# EAGLE board MC88110_SmokeTest (EAGLE 9.7.0), part 1 of 2
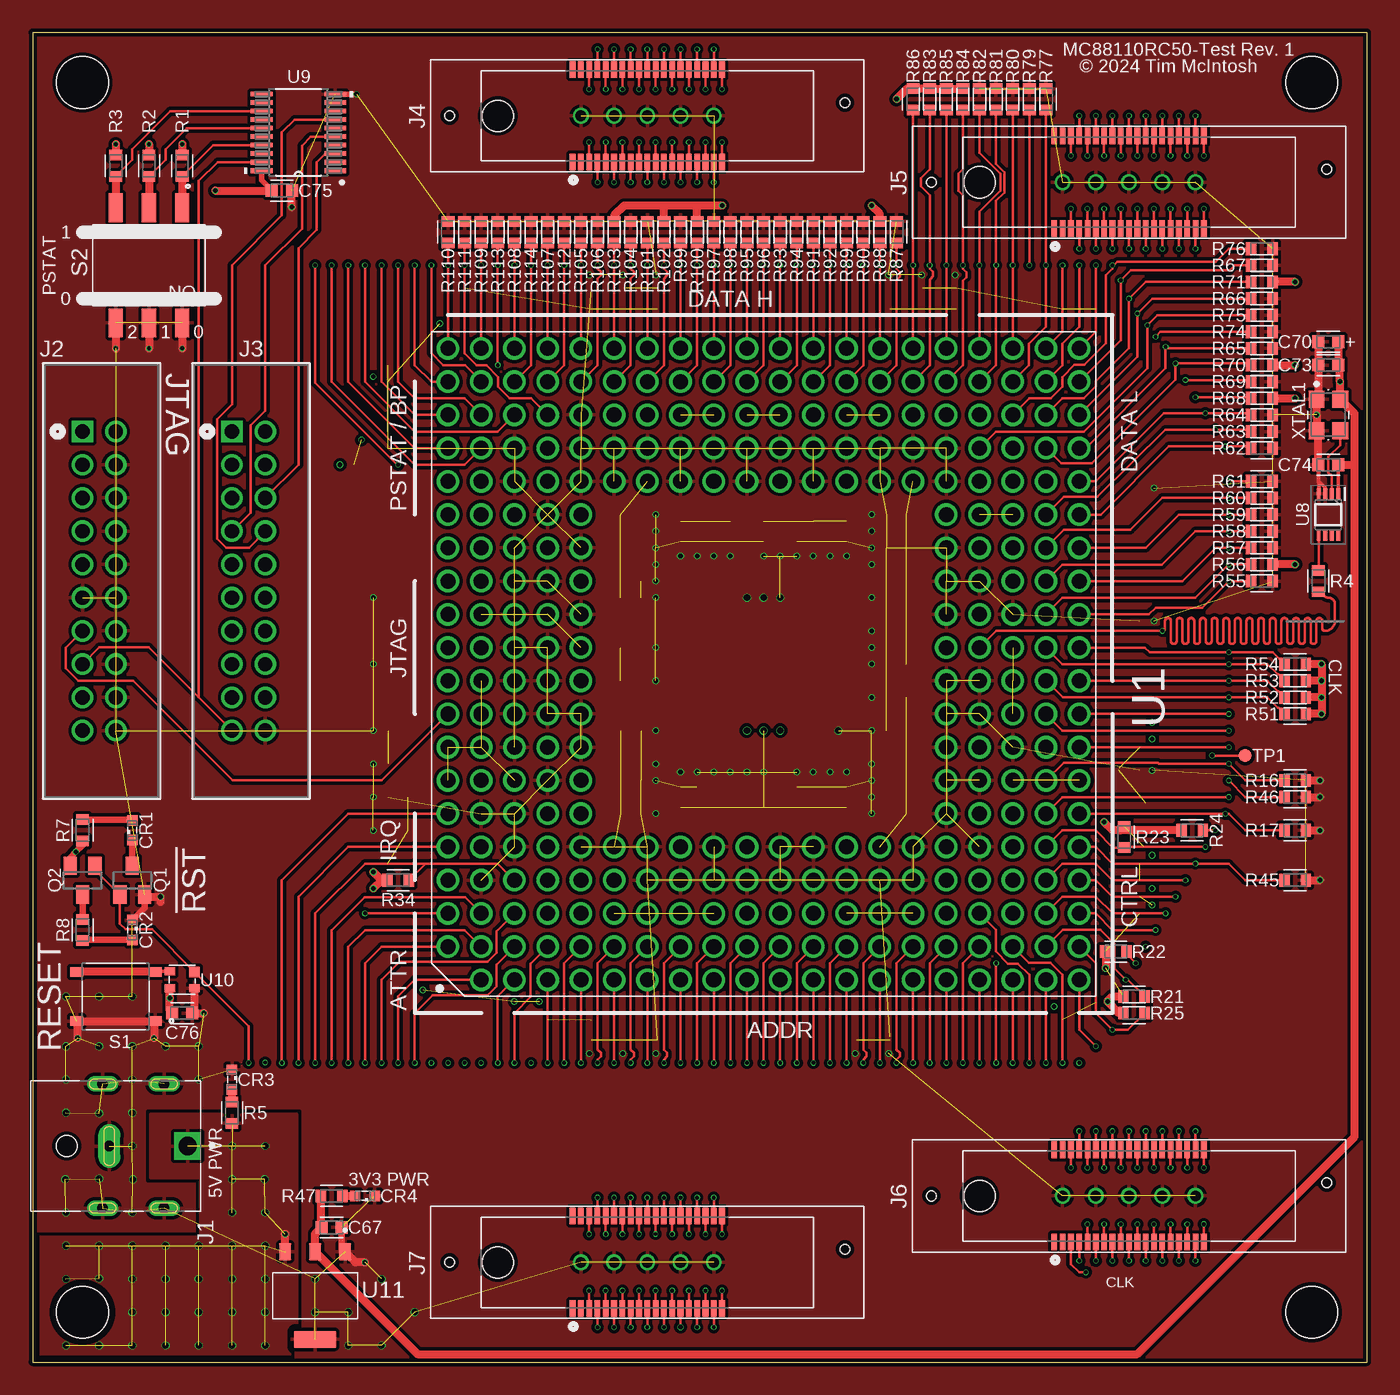
[diagram p2: board, top side]
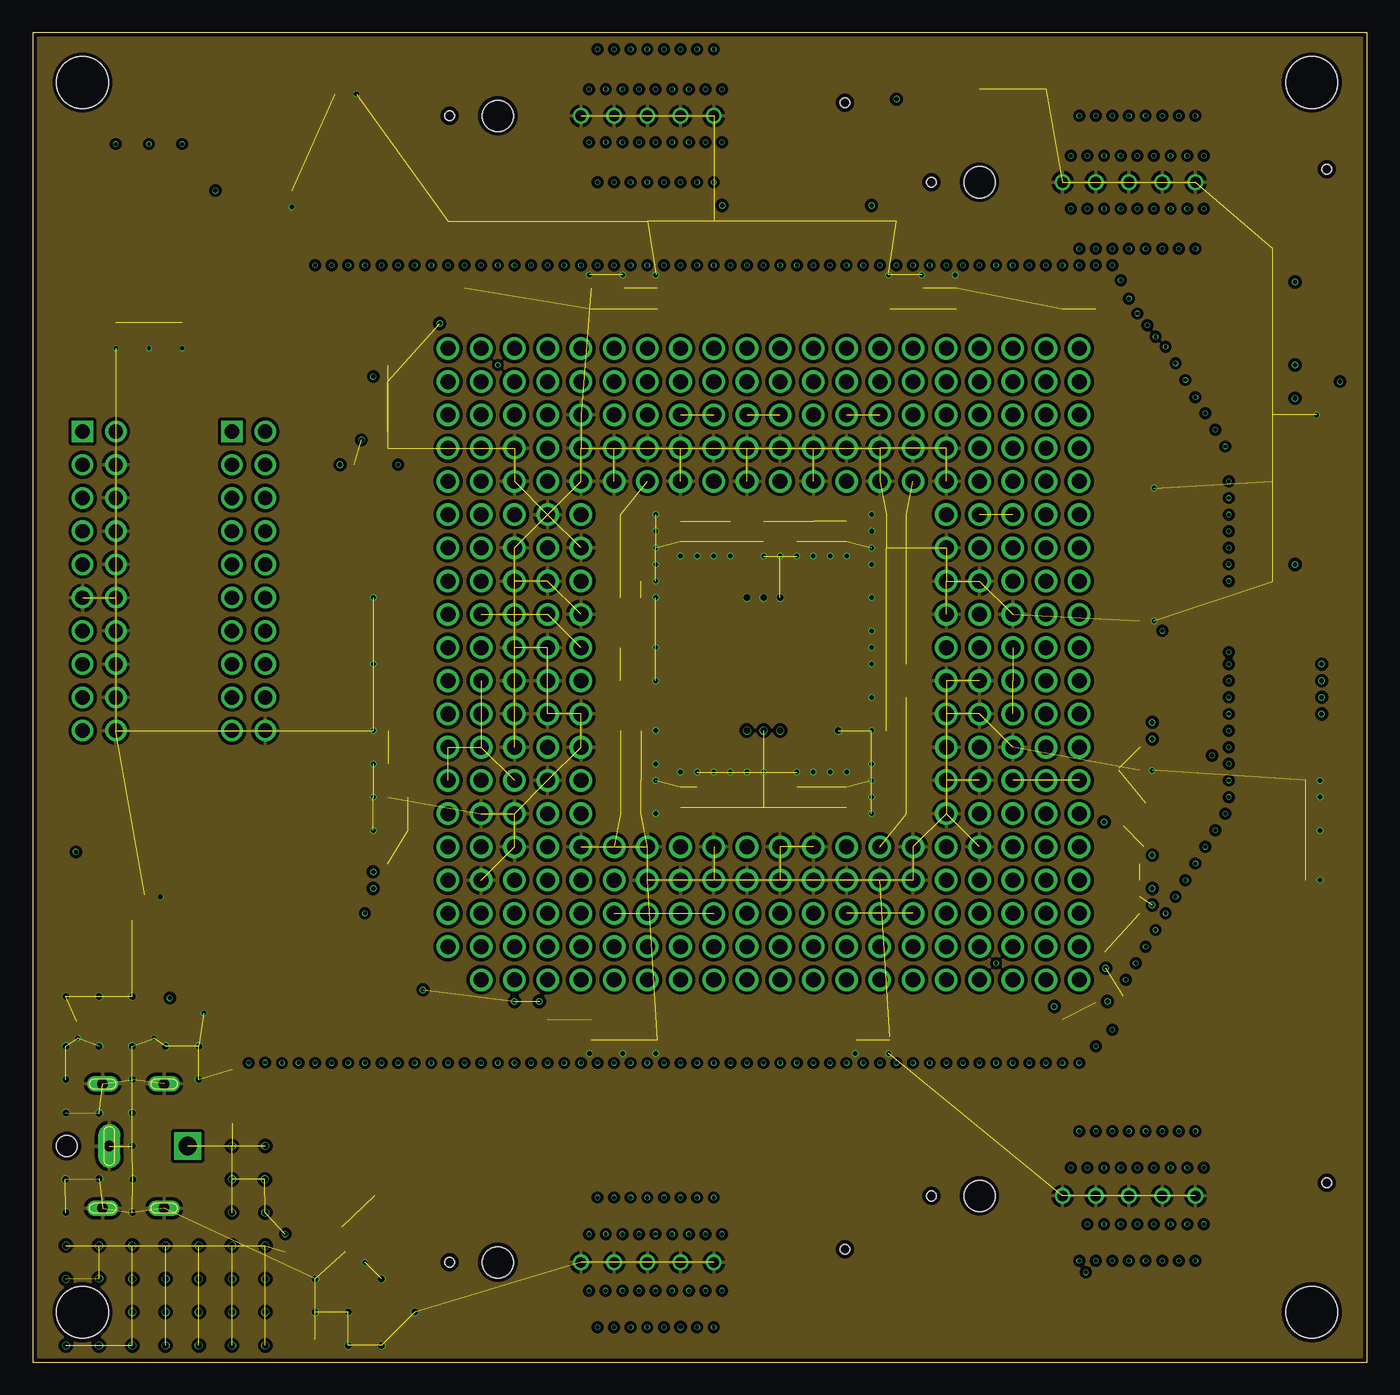
[diagram p3: board, inner layer Route2]
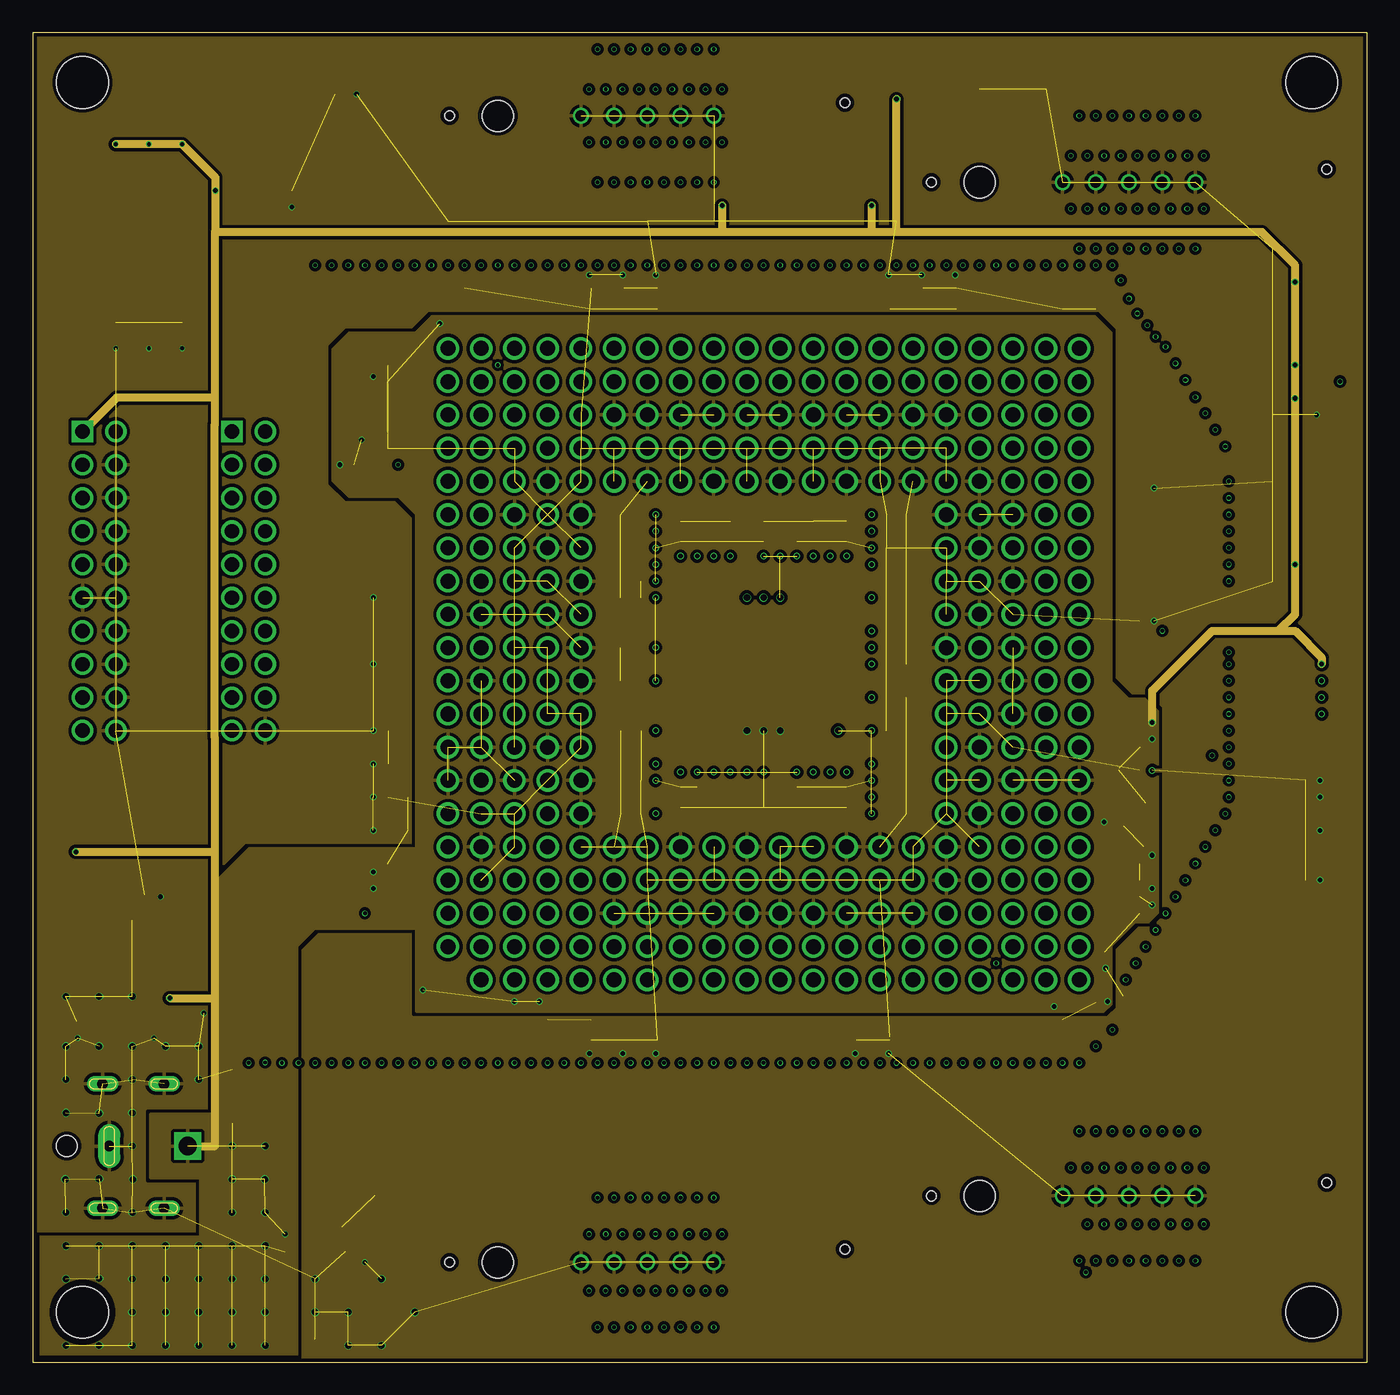
[diagram p4: board, inner layer Route15]
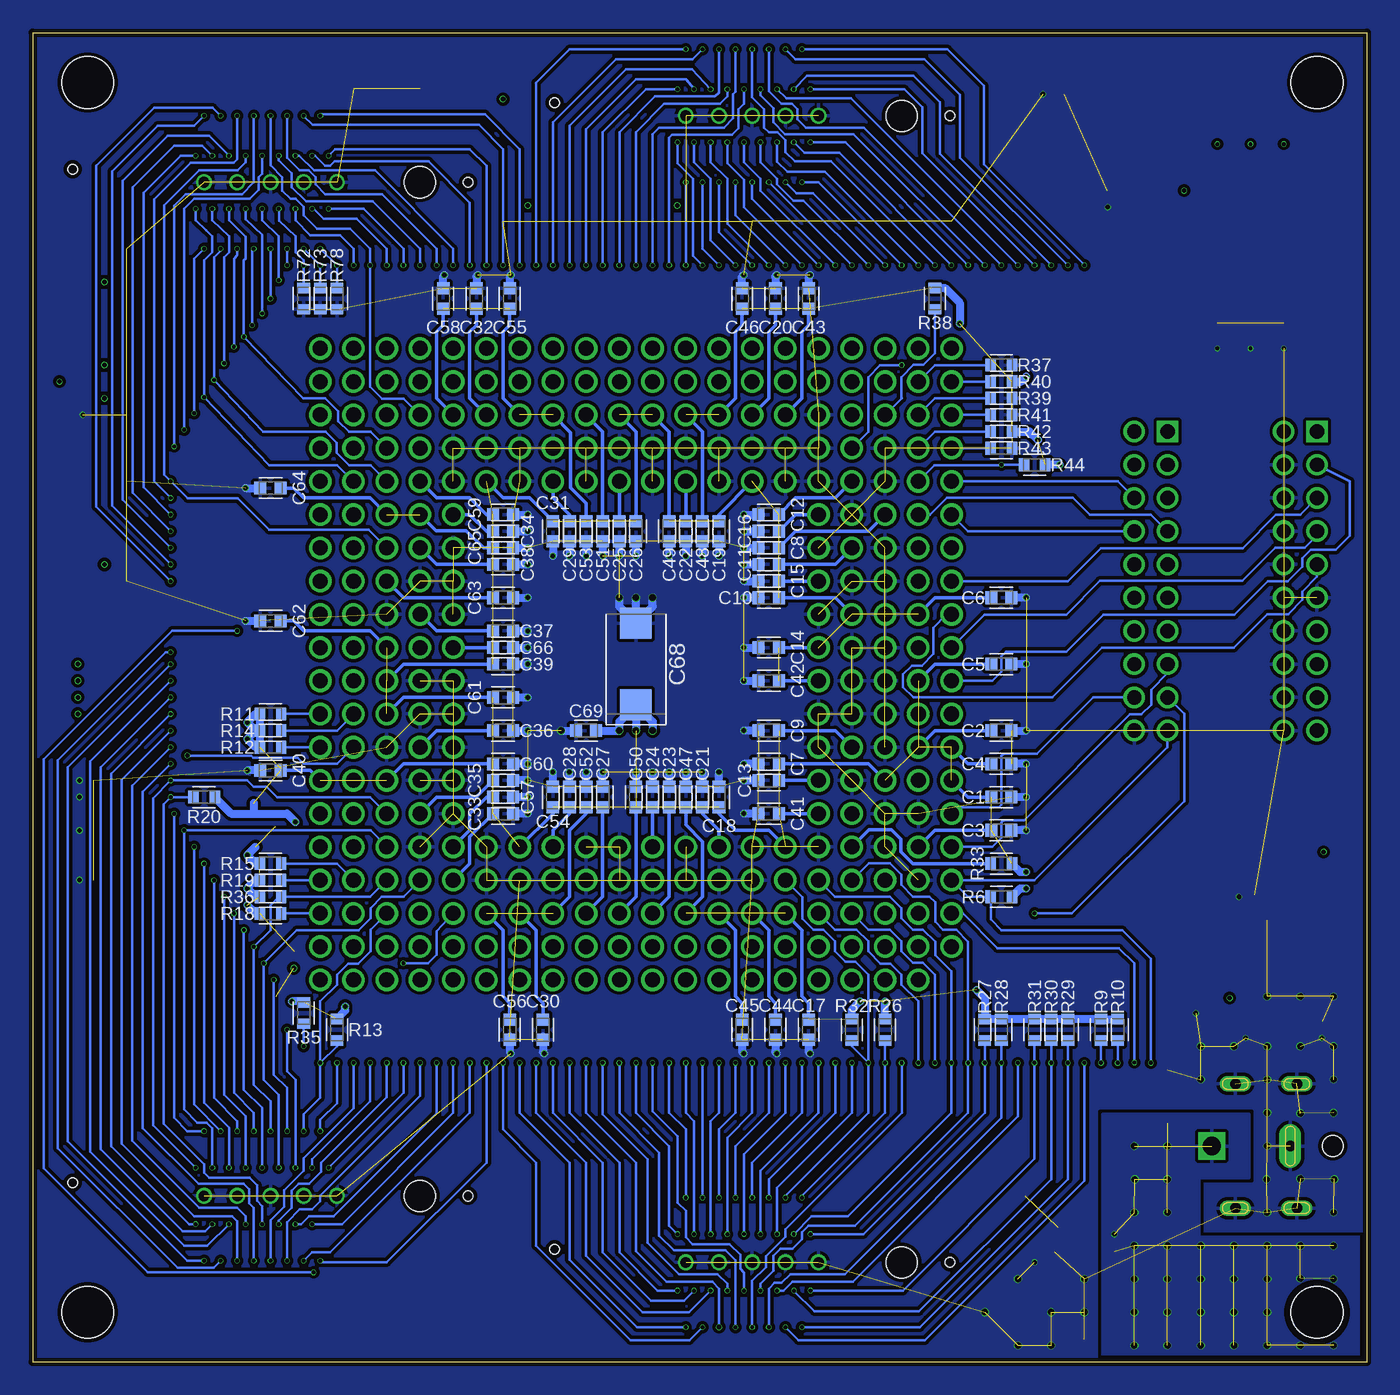
[diagram p5: board, bottom side, seen from below]

Size 102 x 101.6 mm. Coordinates in mm from the lower left corner, seen from the top.
Outline: 0,0 102,0 102,101.6 0,101.6 0,0
Copper layers (1+2+15+16): Top 0.035mm / dielectric 0.2mm / Route2 0.0175mm / dielectric 1.065mm / Route15 0.0175mm / dielectric 0.2mm / Bottom 0.035mm
Design rules "jlcpcb-4layers *": minimum track width 0.09mm, minimum drill 0.2mm, track to track 0.09mm, track to pad 0.2mm, pad to pad 5mil, via to via 0.5mm, smd to smd 5mil, copper to edge 0.3mm, drill to drill 10mil, minimum pad ring 0.05mm, minimum via ring 0.05mm, stop-mask expansion 0.05mm, vias tented up to drill 16mil, thermal gap 10mil
Holes 3.96 mm at 3.81,3.81 3.81,97.79 97.79,97.79 97.79,3.81

## Footprints (pad centres in the part's own frame; a part is rotated, then mirrored left to right if it is on the bottom)
CAPC1608X85 = smd 0.921 x 0.97: 1 -0.775,0; 2 0.775,0
CAPMP7343X310N = smd 2.368 x 2.404: 1 -3.121,0; 2 3.121,0
SML0603 = smd 0.8 x 0.8: A 0.75,0; C -0.75,0
GLOBTECK_JACK-C-PC-10A-RA(R) = drill 1.4 square: 1 5.5,0 | drill 0.8 pad 1.7 long: 2 -0.5,0 | drill 0.8 pad 1.2 long: P1 3.7,4.75; P2 3.7,-4.75; P3 -1,4.75; P4 -1,-4.75 | hole 1.6: -3.75,0
CONN_30320-6002HB_3MM = drill 1.092 pad 1.6 square: 1 -11.43,-1.27 | drill 1.092 pad 1.6: 2 -11.43,1.27; 3 -8.89,-1.27; 4 -8.89,1.27; 5 -6.35,-1.27; 6 -6.35,1.27; 7 -3.81,-1.27; 8 -3.81,1.27; 9 -1.27,-1.27; 10 -1.27,1.27; 11 1.27,-1.27; 12 1.27,1.27; 13 3.81,-1.27; 14 3.81,1.27; 15 6.35,-1.27; 16 6.35,1.27; 17 8.89,-1.27; 18 8.89,1.27; 19 11.43,-1.27; 20 11.43,1.27
TE_2-767004-2 = smd 1.27 x 0.43: 1 -3.53,5.715; 2 3.53,5.715; 3 -3.53,5.08; 4 3.53,5.08; 5 -3.53,4.445; 6 3.53,4.445; 7 -3.53,3.81; 8 3.53,3.81; 9 -3.53,3.175; 10 3.53,3.175; 11 -3.53,2.54; 12 3.53,2.54; 13 -3.53,1.905; 14 3.53,1.905; 15 -3.53,1.27; 16 3.53,1.27; 17 -3.53,0.635; 18 3.53,0.635; 19 -3.53,0; 20 3.53,0; 21 -3.53,-0.635; 22 3.53,-0.635; 23 -3.53,-1.27; 24 3.53,-1.27; 25 -3.53,-1.905; 26 3.53,-1.905; 27 -3.53,-2.54; 28 3.53,-2.54; 29 -3.53,-3.175; 30 3.53,-3.175; 31 -3.53,-3.81; 32 3.53,-3.81; 33 -3.53,-4.445; 34 3.53,-4.445; 35 -3.53,-5.08; 36 3.53,-5.08; 37 -3.53,-5.715; 38 3.53,-5.715 | drill 0.81: G1 0,5.08; G2 0,2.54; G3 0,0; G4 0,-2.54; G5 0,-5.08 | hole 2.39: 0,11.43 | hole 0.76: 0,15.115; 1,-15.115
SOT23 = smd 1 x 1.4: 1 -0.95,-1.1; 2 0.95,-1.1; 3 0,1.1
RESC1608X60 = smd 0.799 x 0.974: 1 -0.815,0; 2 0.815,0
SW_TS-1187A-B-A-B = smd 1 x 0.75: A -3,1.875; B 3,1.875; C -3,-1.875; D 3,-1.875
SW_DS04-254-1-03BK-SMT = smd 2.2 x 1.1: 1A -4.4,2.54; 1B 4.4,2.54; 2A -4.4,0; 2B 4.4,0; 3A -4.4,-2.54; 3B 4.4,-2.54
TP10R = smd 1 x 1: TP 0,0
PGA299 = drill 1.15 pad 1.5: A2 50.8,48.26; A3 50.8,45.72; A4 50.8,43.18; A5 50.8,40.64; A6 50.8,38.1; A7 50.8,35.56; A8 50.8,33.02; A9 50.8,30.48; A10 50.8,27.94; A11 50.8,25.4; A12 50.8,22.86; A13 50.8,20.32; A14 50.8,17.78; A15 50.8,15.24; A16 50.8,12.7; A17 50.8,10.16; A18 50.8,7.62; A19 50.8,5.08; A20 50.8,2.54; B1 48.26,50.8; B2 48.26,48.26; B3 48.26,45.72; B4 48.26,43.18; B5 48.26,40.64; B6 48.26,38.1; B7 48.26,35.56; B8 48.26,33.02; B9 48.26,30.48; B10 48.26,27.94; B11 48.26,25.4; B12 48.26,22.86; B13 48.26,20.32; B14 48.26,17.78; B15 48.26,15.24; B16 48.26,12.7; B17 48.26,10.16; B18 48.26,7.62; B19 48.26,5.08; B20 48.26,2.54; C1 45.72,50.8; C2 45.72,48.26; C3 45.72,45.72; C4 45.72,43.18; C5 45.72,40.64; C6 45.72,38.1; C7 45.72,35.56; C8 45.72,33.02; C9 45.72,30.48; C10 45.72,27.94; C11 45.72,25.4; C12 45.72,22.86; C13 45.72,20.32; C14 45.72,17.78; C15 45.72,15.24; C16 45.72,12.7; C17 45.72,10.16; C18 45.72,7.62; C19 45.72,5.08; C20 45.72,2.54; D1 43.18,50.8; D2 43.18,48.26; D3 43.18,45.72; D4 43.18,43.18; D5 43.18,40.64; D6 43.18,38.1; D7 43.18,35.56; D8 43.18,33.02; D9 43.18,30.48; D10 43.18,27.94; D11 43.18,25.4; D12 43.18,22.86; D13 43.18,20.32; D14 43.18,17.78; D15 43.18,15.24; D16 43.18,12.7; D17 43.18,10.16; D18 43.18,7.62; D19 43.18,5.08; D20 43.18,2.54; E1 40.64,50.8; E2 40.64,48.26; E3 40.64,45.72; E4 40.64,43.18; E5 40.64,40.64; E6 40.64,38.1; E7 40.64,35.56; E8 40.64,33.02; E9 40.64,30.48; E10 40.64,27.94; E11 40.64,25.4; E12 40.64,22.86; E13 40.64,20.32; E14 40.64,17.78; E15 40.64,15.24; E16 40.64,12.7; E17 40.64,10.16; E18 40.64,7.62; E19 40.64,5.08; E20 40.64,2.54; F1 38.1,50.8; F2 38.1,48.26; F3 38.1,45.72; F4 38.1,43.18; F5 38.1,40.64; F16 38.1,12.7; F17 38.1,10.16; F18 38.1,7.62; F19 38.1,5.08; F20 38.1,2.54; G1 35.56,50.8; G2 35.56,48.26; G3 35.56,45.72; G4 35.56,43.18; G5 35.56,40.64; G16 35.56,12.7; G17 35.56,10.16; G18 35.56,7.62; G19 35.56,5.08; G20 35.56,2.54; H1 33.02,50.8; H2 33.02,48.26; H3 33.02,45.72; H4 33.02,43.18; H5 33.02,40.64; H16 33.02,12.7; H17 33.02,10.16; H18 33.02,7.62; H19 33.02,5.08; H20 33.02,2.54; J1 30.48,50.8; J2 30.48,48.26; J3 30.48,45.72; J4 30.48,43.18; J5 30.48,40.64; J16 30.48,12.7; J17 30.48,10.16; J18 30.48,7.62; J19 30.48,5.08; J20 30.48,2.54; K1 27.94,50.8; K2 27.94,48.26; K3 27.94,45.72; K4 27.94,43.18; K5 27.94,40.64; K16 27.94,12.7; K17 27.94,10.16; K18 27.94,7.62; K19 27.94,5.08; K20 27.94,2.54; L1 25.4,50.8; L2 25.4,48.26; L3 25.4,45.72; L4 25.4,43.18; L5 25.4,40.64; L16 25.4,12.7; L17 25.4,10.16; L18 25.4,7.62; L19 25.4,5.08; L20 25.4,2.54; M1 22.86,50.8; M2 22.86,48.26; M3 22.86,45.72; M4 22.86,43.18; M5 22.86,40.64; M16 22.86,12.7; M17 22.86,10.16; M18 22.86,7.62; M19 22.86,5.08; M20 22.86,2.54; N1 20.32,50.8; N2 20.32,48.26; N3 20.32,45.72; N4 20.32,43.18; N5 20.32,40.64; N16 20.32,12.7; N17 20.32,10.16; N18 20.32,7.62; N19 20.32,5.08; N20 20.32,2.54; P1 17.78,50.8; P2 17.78,48.26; P3 17.78,45.72; P4 17.78,43.18; P5 17.78,40.64; P16 17.78,12.7; P17 17.78,10.16; P18 17.78,7.62; P19 17.78,5.08; P20 17.78,2.54; R1 15.24,50.8; R2 15.24,48.26; R3 15.24,45.72; R4 15.24,43.18; R5 15.24,40.64; R16 15.24,12.7; R17 15.24,10.16; R18 15.24,7.62; R19 15.24,5.08; R20 15.24,2.54; S1 12.7,50.8; S2 12.7,48.26; S3 12.7,45.72; S4 12.7,43.18; S5 12.7,40.64; S6 12.7,38.1; S7 12.7,35.56; S8 12.7,33.02; S9 12.7,30.48; S10 12.7,27.94; S11 12.7,25.4; S12 12.7,22.86; S13 12.7,20.32; S14 12.7,17.78; S15 12.7,15.24; S16 12.7,12.7; S17 12.7,10.16; S18 12.7,7.62; S19 12.7,5.08; S20 12.7,2.54; T1 10.16,50.8; T2 10.16,48.26; T3 10.16,45.72; T4 10.16,43.18; T5 10.16,40.64; T6 10.16,38.1; T7 10.16,35.56; T8 10.16,33.02; T9 10.16,30.48; T10 10.16,27.94; T11 10.16,25.4; T12 10.16,22.86; T13 10.16,20.32; T14 10.16,17.78; T15 10.16,15.24; T16 10.16,12.7; T17 10.16,10.16; T18 10.16,7.62; T19 10.16,5.08; T20 10.16,2.54; U1 7.62,50.8; U2 7.62,48.26; U3 7.62,45.72; U4 7.62,43.18; U5 7.62,40.64; U6 7.62,38.1; U7 7.62,35.56; U8 7.62,33.02; U9 7.62,30.48; U10 7.62,27.94; U11 7.62,25.4; U12 7.62,22.86; U13 7.62,20.32; U14 7.62,17.78; U15 7.62,15.24; U16 7.62,12.7; U17 7.62,10.16; U18 7.62,7.62; U19 7.62,5.08; U20 7.62,2.54; V1 5.08,50.8; V2 5.08,48.26; V3 5.08,45.72; V4 5.08,43.18; V5 5.08,40.64; V6 5.08,38.1; V7 5.08,35.56; V8 5.08,33.02; V9 5.08,30.48; V10 5.08,27.94; V11 5.08,25.4; V12 5.08,22.86; V13 5.08,20.32; V14 5.08,17.78; V15 5.08,15.24; V16 5.08,12.7; V17 5.08,10.16; V18 5.08,7.62; V19 5.08,5.08; V20 5.08,2.54; W1 2.54,50.8; W2 2.54,48.26; W3 2.54,45.72; W4 2.54,43.18; W5 2.54,40.64; W6 2.54,38.1; W7 2.54,35.56; W8 2.54,33.02; W9 2.54,30.48; W10 2.54,27.94; W11 2.54,25.4; W12 2.54,22.86; W13 2.54,20.32; W14 2.54,17.78; W15 2.54,15.24; W16 2.54,12.7; W17 2.54,10.16; W18 2.54,7.62; W19 2.54,5.08; W20 2.54,2.54
SOP50P310X100-8N = smd 0.85 x 0.3: 1 -1.575,0.75; 2 -1.575,0.25; 3 -1.575,-0.25; 4 -1.575,-0.75; 5 1.575,-0.75; 6 1.575,-0.25; 7 1.575,0.25; 8 1.575,0.75
PW20 = smd 1.676 x 0.356: 1 -2.819,2.925; 2 -2.819,2.275; 3 -2.819,1.625; 4 -2.819,0.975; 5 -2.819,0.325; 6 -2.819,-0.325; 7 -2.819,-0.975; 8 -2.819,-1.625; 9 -2.819,-2.275; 10 -2.819,-2.925; 11 2.819,-2.925; 12 2.819,-2.275; 13 2.819,-1.625; 14 2.819,-0.975; 15 2.819,-0.325; 16 2.819,0.325; 17 2.819,0.975; 18 2.819,1.625; 19 2.819,2.275; 20 2.819,2.925
R3132Q = smd 0.6 x 0.8: P$1 -0.65,-0.95; P$3 0.65,0.95; P$4 -0.65,0.95 | smd 0.8 x 0.8: P$2 0.6,-0.95
SOT229P700X180-4N = smd 1.31 x 0.93: 1 -3.345,2.29; 2 -3.345,0; 3 -3.345,-2.29 | smd 1.31 x 3.24: 4 3.345,0
OSCCC320X250X90 = smd 1.312 x 1.212: 1 -1.2,-0.9; 2 1.2,-0.9; 3 1.2,0.9; 4 -1.2,0.9

## Placement (x,y rotation side)
C1  100nF  [CAPC1608X85]  27.94,43.18 0 bottom
C2  100nF  [CAPC1608X85]  27.94,48.26 0 bottom
C3  100nF  [CAPC1608X85]  27.94,40.64 0 bottom
C4  100nF  [CAPC1608X85]  27.94,45.72 0 bottom
C5  100nF  [CAPC1608X85]  27.94,53.34 0 bottom
C6  100nF  [CAPC1608X85]  27.94,58.42 0 bottom
C7  100nF  [CAPC1608X85]  45.72,45.72 180 bottom
C8  100nF  [CAPC1608X85]  45.72,62.23 180 bottom
C9  100nF  [CAPC1608X85]  45.72,48.26 180 bottom
C10  100nF  [CAPC1608X85]  45.72,58.42 180 bottom
C11  100nF  [CAPC1608X85]  45.72,60.96 180 bottom
C12  100nF  [CAPC1608X85]  45.72,64.77 180 bottom
C13  100nF  [CAPC1608X85]  45.72,44.45 180 bottom
C14  100nF  [CAPC1608X85]  45.72,54.61 180 bottom
C15  100nF  [CAPC1608X85]  45.72,59.69 180 bottom
C16  100nF  [CAPC1608X85]  45.72,63.5 180 bottom
C17  100nF  [CAPC1608X85]  42.67,25.4 270 bottom
C18  100nF  [CAPC1608X85]  49.53,43.18 90 bottom
C19  100nF  [CAPC1608X85]  49.53,63.5 270 bottom
C20  100nF  [CAPC1608X85]  45.21,81.28 90 bottom
C21  100nF  [CAPC1608X85]  50.8,43.18 90 bottom
C22  100nF  [CAPC1608X85]  52.07,63.5 270 bottom
C23  100nF  [CAPC1608X85]  53.34,43.18 90 bottom
C24  100nF  [CAPC1608X85]  54.61,43.18 90 bottom
C25  100nF  [CAPC1608X85]  57.15,63.5 270 bottom
C26  100nF  [CAPC1608X85]  55.88,63.5 270 bottom
C27  100nF  [CAPC1608X85]  58.42,43.18 90 bottom
C28  100nF  [CAPC1608X85]  60.96,43.18 90 bottom
C29  100nF  [CAPC1608X85]  60.96,63.5 270 bottom
C30  100nF  [CAPC1608X85]  62.99,25.4 270 bottom
C31  100nF  [CAPC1608X85]  62.23,63.5 270 bottom
C32  100nF  [CAPC1608X85]  68.07,81.28 90 bottom
C33  100nF  [CAPC1608X85]  66.04,41.91 0 bottom
C34  100nF  [CAPC1608X85]  66.04,63.5 0 bottom
C35  100nF  [CAPC1608X85]  66.04,44.45 0 bottom
C36  100nF  [CAPC1608X85]  66.04,48.26 0 bottom
C37  100nF  [CAPC1608X85]  66.04,55.88 0 bottom
C38  100nF  [CAPC1608X85]  66.04,60.96 0 bottom
C39  100nF  [CAPC1608X85]  66.04,53.34 0 bottom
C40  100nF  [CAPC1608X85]  83.82,45.21 180 bottom
C41  100nF  [CAPC1608X85]  45.72,41.91 180 bottom
C42  100nF  [CAPC1608X85]  45.72,52.07 180 bottom
C43  100nF  [CAPC1608X85]  42.67,81.28 90 bottom
C44  100nF  [CAPC1608X85]  45.21,25.4 270 bottom
C45  100nF  [CAPC1608X85]  47.75,25.4 270 bottom
C46  100nF  [CAPC1608X85]  47.75,81.28 90 bottom
C47  100nF  [CAPC1608X85]  52.07,43.18 90 bottom
C48  100nF  [CAPC1608X85]  50.8,63.5 270 bottom
C49  100nF  [CAPC1608X85]  53.34,63.5 270 bottom
C50  100nF  [CAPC1608X85]  55.88,43.18 90 bottom
C51  100nF  [CAPC1608X85]  58.42,63.5 270 bottom
C52  100nF  [CAPC1608X85]  59.69,43.18 90 bottom
C53  100nF  [CAPC1608X85]  59.69,63.5 270 bottom
C54  100nF  [CAPC1608X85]  62.23,43.18 90 bottom
C55  100nF  [CAPC1608X85]  65.53,81.28 90 bottom
C56  100nF  [CAPC1608X85]  65.53,25.4 270 bottom
C57  100nF  [CAPC1608X85]  66.04,43.18 0 bottom
C58  100nF  [CAPC1608X85]  70.61,81.28 90 bottom
C59  100nF  [CAPC1608X85]  66.04,64.77 0 bottom
C60  100nF  [CAPC1608X85]  66.04,45.72 0 bottom
C61  100nF  [CAPC1608X85]  66.04,50.8 0 bottom
C62  100nF  [CAPC1608X85]  83.82,56.64 180 bottom
C63  100nF  [CAPC1608X85]  66.04,58.42 0 bottom
C64  100nF  [CAPC1608X85]  83.82,66.8 180 bottom
C65  100nF  [CAPC1608X85]  66.04,62.23 0 bottom
C66  100nF  [CAPC1608X85]  66.04,54.61 0 bottom
C67  22uF  [CAPC1608X85]  22.86,10.29 0 top
C68  100uF  [CAPMP7343X310N]  55.88,53.34 90 bottom
C69  22uF  [CAPC1608X85]  59.69,48.26 180 bottom
C70  100uF  [CAPC1608X85]  99.06,77.98 180 top
C73  100nF  [CAPC1608X85]  99.06,76.2 180 top
C74  100nF  [CAPC1608X85]  99.06,68.58 180 top
C75  100nF  [CAPC1608X85]  19.05,89.53 0 top
C76  100nF  [CAPC1608X85]  11.43,26.67 0 top
CR1  GREEN  [SML0603]  7.62,40.64 90 top
CR2  RED  [SML0603]  7.62,33.02 270 top
CR3  GREEN  [SML0603]  15.24,21.59 270 top
CR4  GREEN  [SML0603]  25.4,12.7 180 top
J1  JACK-C-PC-10A-RA(R)  [GLOBTECK_JACK-C-PC-10A-RA(R)]  6.35,16.51 0 top
J2  30320-6002HBCONN_30320-6002HB_3MM  [CONN_30320-6002HB_3MM]  5.08,59.69 270 top
J3  30320-6002HBCONN_30320-6002HB_3MM  [CONN_30320-6002HB_3MM]  16.51,59.69 270 top
J4  [TE_2-767004-2]  46.99,95.25 90 top
J5  [TE_2-767004-2]  83.82,90.17 90 top
J6  [TE_2-767004-2]  83.82,12.7 90 top
J7  [TE_2-767004-2]  46.99,7.62 90 top
Q1  NMOSFET  [SOT23]  7.62,36.83 0 top
Q2  PMOSFET  [SOT23]  3.81,36.83 180 top
R1  1K  [RESC1608X60]  11.43,91.44 90 top
R2  1K  [RESC1608X60]  8.89,91.44 90 top
R3  1K  [RESC1608X60]  6.35,91.44 90 top
R4  0R  [RESC1608X60]  98.3,59.69 270 top
R5  220R  [RESC1608X60]  15.24,19.05 270 top
R6  10K  [RESC1608X60]  27.94,35.56 180 bottom
R7  220R  [RESC1608X60]  3.81,40.64 270 top
R8  330R  [RESC1608X60]  3.81,33.02 90 top
R9  10K  [RESC1608X60]  20.32,25.4 90 bottom
R10  10K  [RESC1608X60]  19.05,25.4 90 bottom
R11  10K  [RESC1608X60]  83.82,49.53 180 bottom
R12  10K  [RESC1608X60]  83.82,46.99 180 bottom
R13  10K  [RESC1608X60]  78.74,25.4 90 bottom
R14  10K  [RESC1608X60]  83.82,48.26 180 bottom
R15  10K  [RESC1608X60]  83.82,38.1 180 bottom
R16  4K7  [RESC1608X60]  96.52,44.45 180 top
R17  4K7  [RESC1608X60]  96.52,40.64 180 top
R18  10K  [RESC1608X60]  83.82,34.29 180 bottom
R19  10K  [RESC1608X60]  83.82,36.83 180 bottom
R20  10K  [RESC1608X60]  88.9,43.18 0 bottom
R21  10K  [RESC1608X60]  84.2,27.94 180 top
R22  10K  [RESC1608X60]  82.8,31.37 180 top
R23  10K  [RESC1608X60]  83.44,40.13 90 top
R24  10K  [RESC1608X60]  88.65,40.64 180 top
R25  10K  [RESC1608X60]  84.2,26.67 180 top
R26  4K7  [RESC1608X60]  36.83,25.4 90 bottom
R27  4K7  [RESC1608X60]  29.21,25.4 90 bottom
R28  4K7  [RESC1608X60]  27.94,25.4 90 bottom
R29  4K7  [RESC1608X60]  22.86,25.4 90 bottom
R30  4K7  [RESC1608X60]  24.13,25.4 90 bottom
R31  4K7  [RESC1608X60]  25.4,25.4 90 bottom
R32  4K7  [RESC1608X60]  39.37,25.4 90 bottom
R33  10K  [RESC1608X60]  27.94,38.1 0 bottom
R34  1K  [RESC1608X60]  27.94,36.83 180 top
R35  1K  [RESC1608X60]  81.28,26.67 90 bottom
R36  1K  [RESC1608X60]  83.82,35.56 180 bottom
R37  1K  [RESC1608X60]  27.94,76.2 0 bottom
R38  1K  [RESC1608X60]  33.02,81.28 90 bottom
R39  1K  [RESC1608X60]  27.94,73.66 0 bottom
R40  1K  [RESC1608X60]  27.94,74.93 0 bottom
R41  1K  [RESC1608X60]  27.94,72.39 0 bottom
R42  1K  [RESC1608X60]  27.94,71.12 0 bottom
R43  1K  [RESC1608X60]  27.94,69.85 0 bottom
R44  1K  [RESC1608X60]  25.4,68.58 0 bottom
R45  4K7  [RESC1608X60]  96.52,36.83 180 top
R46  4K7  [RESC1608X60]  96.52,43.18 180 top
R47  47R  [RESC1608X60]  22.86,12.7 180 top
R51  4K7  [RESC1608X60]  96.52,49.53 0 top
R52  4K7  [RESC1608X60]  96.52,50.8 0 top
R53  4K7  [RESC1608X60]  96.52,52.07 0 top
R54  4K7  [RESC1608X60]  96.52,53.34 0 top
R55  4K7  [RESC1608X60]  93.98,59.69 0 top
R56  4K7  [RESC1608X60]  93.98,60.96 0 top
R57  4K7  [RESC1608X60]  93.98,62.23 0 top
R58  4K7  [RESC1608X60]  93.98,63.5 0 top
R59  4K7  [RESC1608X60]  93.98,64.77 0 top
R60  4K7  [RESC1608X60]  93.98,66.04 0 top
R61  4K7  [RESC1608X60]  93.98,67.31 0 top
R62  4K7  [RESC1608X60]  93.98,69.85 0 top
R63  4K7  [RESC1608X60]  93.98,71.12 0 top
R64  4K7  [RESC1608X60]  93.98,72.39 0 top
R65  4K7  [RESC1608X60]  93.98,77.47 0 top
R66  4K7  [RESC1608X60]  93.98,81.28 0 top
R67  4K7  [RESC1608X60]  93.98,83.82 0 top
R68  4K7  [RESC1608X60]  93.98,73.66 0 top
R69  4K7  [RESC1608X60]  93.98,74.93 0 top
R70  4K7  [RESC1608X60]  93.98,76.2 0 top
R71  4K7  [RESC1608X60]  93.98,82.55 0 top
R72  4K7  [RESC1608X60]  81.28,81.28 270 bottom
R73  4K7  [RESC1608X60]  80.01,81.28 270 bottom
R74  4K7  [RESC1608X60]  93.98,78.74 0 top
R75  4K7  [RESC1608X60]  93.98,80.01 0 top
R76  4K7  [RESC1608X60]  93.98,85.09 0 top
R77  4K7  [RESC1608X60]  77.47,96.52 90 top
R78  4K7  [RESC1608X60]  78.74,81.28 270 bottom
R79  4K7  [RESC1608X60]  76.2,96.52 90 top
R80  4K7  [RESC1608X60]  74.93,96.52 90 top
R81  4K7  [RESC1608X60]  73.66,96.52 90 top
R82  4K7  [RESC1608X60]  72.39,96.52 90 top
R83  4K7  [RESC1608X60]  68.58,96.52 90 top
R84  4K7  [RESC1608X60]  71.12,96.52 90 top
R85  4K7  [RESC1608X60]  69.85,96.52 90 top
R86  4K7  [RESC1608X60]  67.31,96.52 90 top
R87  4K7  [RESC1608X60]  66.04,86.36 90 top
R88  4K7  [RESC1608X60]  64.77,86.36 90 top
R89  4K7  [RESC1608X60]  62.23,86.36 90 top
R90  4K7  [RESC1608X60]  63.5,86.36 90 top
R91  4K7  [RESC1608X60]  59.69,86.36 90 top
R92  4K7  [RESC1608X60]  60.96,86.36 90 top
R93  4K7  [RESC1608X60]  57.15,86.36 90 top
R94  4K7  [RESC1608X60]  58.42,86.36 90 top
R95  4K7  [RESC1608X60]  54.61,86.36 90 top
R96  4K7  [RESC1608X60]  55.88,86.36 90 top
R97  4K7  [RESC1608X60]  52.07,86.36 90 top
R98  4K7  [RESC1608X60]  53.34,86.36 90 top
R99  4K7  [RESC1608X60]  49.53,86.36 90 top
R100  4K7  [RESC1608X60]  50.8,86.36 90 top
R101  4K7  [RESC1608X60]  46.99,86.36 90 top
R102  4K7  [RESC1608X60]  48.26,86.36 90 top
R103  4K7  [RESC1608X60]  44.45,86.36 90 top
R104  4K7  [RESC1608X60]  45.72,86.36 90 top
R105  4K7  [RESC1608X60]  41.91,86.36 90 top
R106  4K7  [RESC1608X60]  43.18,86.36 90 top
R107  4K7  [RESC1608X60]  39.37,86.36 90 top
R108  4K7  [RESC1608X60]  36.83,86.36 90 top
R109  4K7  [RESC1608X60]  34.29,86.36 90 top
R110  4K7  [RESC1608X60]  31.75,86.36 90 top
R111  4K7  [RESC1608X60]  33.02,86.36 90 top
R112  4K7  [RESC1608X60]  40.64,86.36 90 top
R113  4K7  [RESC1608X60]  35.56,86.36 90 top
R114  4K7  [RESC1608X60]  38.1,86.36 90 top
S1  TS-1187A-B-A-B  [SW_TS-1187A-B-A-B]  6.35,27.94 180 top
S2  DS04-254-1-03BK-SMT  [SW_DS04-254-1-03BK-SMT]  8.89,83.82 270 top
TP1  TPTP10R  [TP10R]  92.71,46.35 0 top
U1  MC88110RC50H  [PGA299]  82.55,80.01 180 top
U8  74AVC9112DCH  [SOP50P310X100-8N]  99.06,64.77 270 top
U9  74HCT244PW  [PW20]  20.32,93.98 180 top
U10  R3132Q47EA-TR-FE  [R3132Q]  11.43,29.21 90 top
U11  AMS1117-3.3  [SOT229P700X180-4N]  21.59,5.08 270 top
XTAL1  50.000  [OSCCC320X250X90]  99.06,72.39 270 top